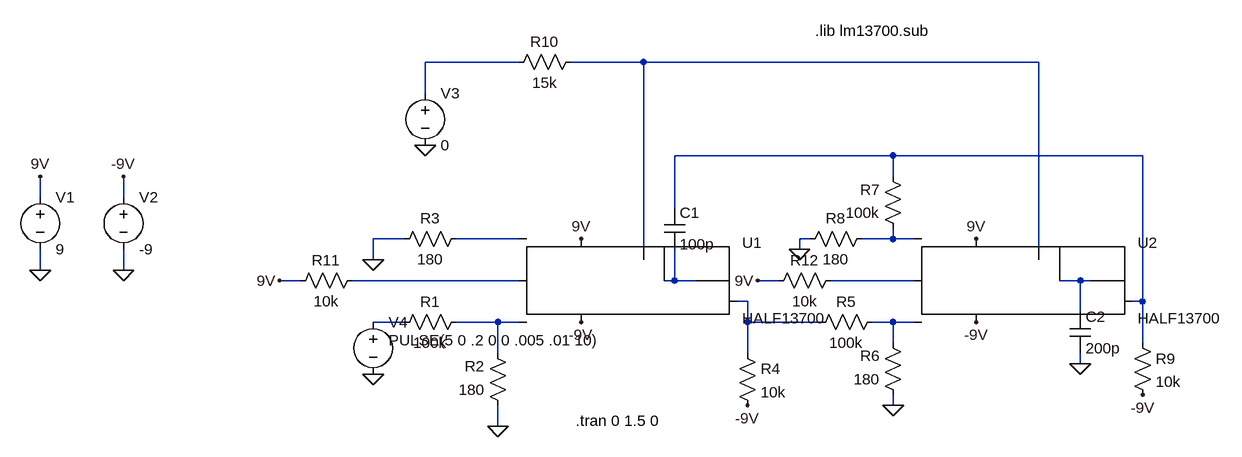
[diagram p0: schematic LM138002PolePulseTransient.asc]
LM138002PolePulseTransient.asc, the LTspice schematic file:
Version 4
SHEET 1 1124 680
WIRE -32 -160 -176 -160
WIRE 160 -160 48 -160
WIRE 768 -160 160 -160
WIRE -176 -112 -176 -160
WIRE 544 -16 208 -16
WIRE 928 -16 544 -16
WIRE 544 16 544 -16
WIRE -768 48 -768 16
WIRE -640 48 -640 16
WIRE 208 64 208 -16
WIRE -208 112 -256 112
WIRE -32 112 -128 112
WIRE 416 112 400 112
WIRE 544 112 544 96
WIRE 544 112 496 112
WIRE 576 112 544 112
WIRE 400 128 400 112
WIRE -256 144 -256 112
WIRE 160 144 160 -160
WIRE 768 144 768 -160
WIRE -768 160 -768 128
WIRE -640 160 -640 128
WIRE -368 176 -400 176
WIRE -32 176 -288 176
WIRE 208 176 208 128
WIRE 208 176 192 176
WIRE 240 176 208 176
WIRE 368 176 336 176
WIRE 576 176 448 176
WIRE 832 176 800 176
WIRE 848 176 832 176
WIRE 320 208 304 208
WIRE 928 208 928 -16
WIRE 928 208 912 208
WIRE 832 224 832 176
WIRE -208 240 -256 240
WIRE -64 240 -128 240
WIRE -32 240 -64 240
WIRE 320 240 320 208
WIRE 432 240 320 240
WIRE 544 240 512 240
WIRE 576 240 544 240
WIRE 544 272 544 240
WIRE 928 272 928 208
WIRE -64 288 -64 240
WIRE 320 288 320 240
WIRE 832 304 832 288
WIRE 544 368 544 352
WIRE -64 400 -64 368
FLAG -64 400 0
FLAG -256 144 0
FLAG 400 128 0
FLAG 544 368 0
FLAG 832 304 0
FLAG -768 16 9V
FLAG -640 16 -9V
FLAG -768 160 0
FLAG -640 160 0
FLAG 64 112 9V
FLAG 672 112 9V
FLAG 64 240 -9V
FLAG 672 240 -9V
FLAG 320 368 -9V
FLAG 928 352 -9V
FLAG -176 -32 0
FLAG -256 320 0
FLAG -400 176 9V
FLAG 336 176 9V
SYMBOL LM13700 32 96 R0
SYMATTR InstName U1
SYMBOL LM13700 640 96 R0
SYMATTR InstName U2
SYMBOL res -112 224 R90
WINDOW 0 0 56 VBottom 2
WINDOW 3 32 56 VTop 2
SYMATTR InstName R1
SYMATTR Value 100k
SYMBOL res -48 384 R180
WINDOW 0 36 76 Left 2
WINDOW 3 36 40 Left 2
SYMATTR InstName R2
SYMATTR Value 180
SYMBOL res -112 96 R90
WINDOW 0 0 56 VBottom 2
WINDOW 3 32 56 VTop 2
SYMATTR InstName R3
SYMATTR Value 180
SYMBOL res 304 272 R0
SYMATTR InstName R4
SYMATTR Value 10k
SYMBOL res 528 224 R90
WINDOW 0 0 56 VBottom 2
WINDOW 3 32 56 VTop 2
SYMATTR InstName R5
SYMATTR Value 100k
SYMBOL res 560 368 R180
WINDOW 0 36 76 Left 2
WINDOW 3 36 40 Left 2
SYMATTR InstName R6
SYMATTR Value 180
SYMBOL res 560 112 R180
WINDOW 0 36 76 Left 2
WINDOW 3 36 40 Left 2
SYMATTR InstName R7
SYMATTR Value 100k
SYMBOL res 400 128 R270
WINDOW 0 32 56 VTop 2
WINDOW 3 0 56 VBottom 2
SYMATTR InstName R8
SYMATTR Value 180
SYMBOL cap 192 64 R0
SYMATTR InstName C1
SYMATTR Value 100p
SYMBOL cap 816 224 R0
SYMATTR InstName C2
SYMATTR Value 200p
SYMBOL res 912 256 R0
SYMATTR InstName R9
SYMATTR Value 10k
SYMBOL voltage -768 32 R0
WINDOW 123 0 0 Left 0
WINDOW 39 0 0 Left 0
SYMATTR InstName V1
SYMATTR Value 9
SYMBOL voltage -640 32 R0
WINDOW 123 0 0 Left 0
WINDOW 39 0 0 Left 0
SYMATTR InstName V2
SYMATTR Value -9
SYMBOL voltage -176 -128 R0
WINDOW 123 0 0 Left 0
WINDOW 39 0 0 Left 0
SYMATTR InstName V3
SYMATTR Value 0
SYMBOL res 64 -176 R90
WINDOW 0 0 56 VBottom 2
WINDOW 3 32 56 VTop 2
SYMATTR InstName R10
SYMATTR Value 15k
SYMBOL voltage -256 224 R0
WINDOW 123 24 124 Left 2
WINDOW 39 0 0 Left 0
WINDOW 3 24 44 Left 2
SYMATTR Value PULSE(5 0 .2 0 0 .005 .01 10)
SYMATTR InstName V4
SYMBOL res -272 160 R90
WINDOW 0 0 56 VBottom 2
WINDOW 3 32 56 VTop 2
SYMATTR InstName R11
SYMATTR Value 10k
SYMBOL res 464 160 R90
WINDOW 0 0 56 VBottom 2
WINDOW 3 32 56 VTop 2
SYMATTR InstName R12
SYMATTR Value 10k
TEXT 424 -208 Left 2 !.lib lm13700.sub
TEXT 56 392 Left 2 !.tran 0 1.5 0

The netlist it stands for:
* LM138002PolePulseTransient.asc
XU1 N006 N012 N004 N002 N007 9V -9V N007 N010 HALF13700
XU2 N008 N013 N005 N002 N009 9V -9V N009 N003 HALF13700
R1 N012 N011 100k
R2 0 N012 180
R3 N004 0 180
R4 N010 -9V 10k
R5 N013 N010 100k
R6 0 N013 180
R7 N005 N003 100k
R8 0 N005 180
C1 N003 N007 100p
C2 N009 0 200p
R9 N003 -9V 10k
V1 9V 0 9
V2 -9V 0 -9
V3 N001 0 0
R10 N002 N001 15k
V4 N011 0 PULSE(5 0 .2 0 0 .005 .01 10)
R11 N006 9V 10k
R12 N008 9V 10k
.lib lm13700.sub
.tran 0 1.5 0
.backanno
.end